# EAGLE design owl-digital-2 (EAGLE 7.5.0)
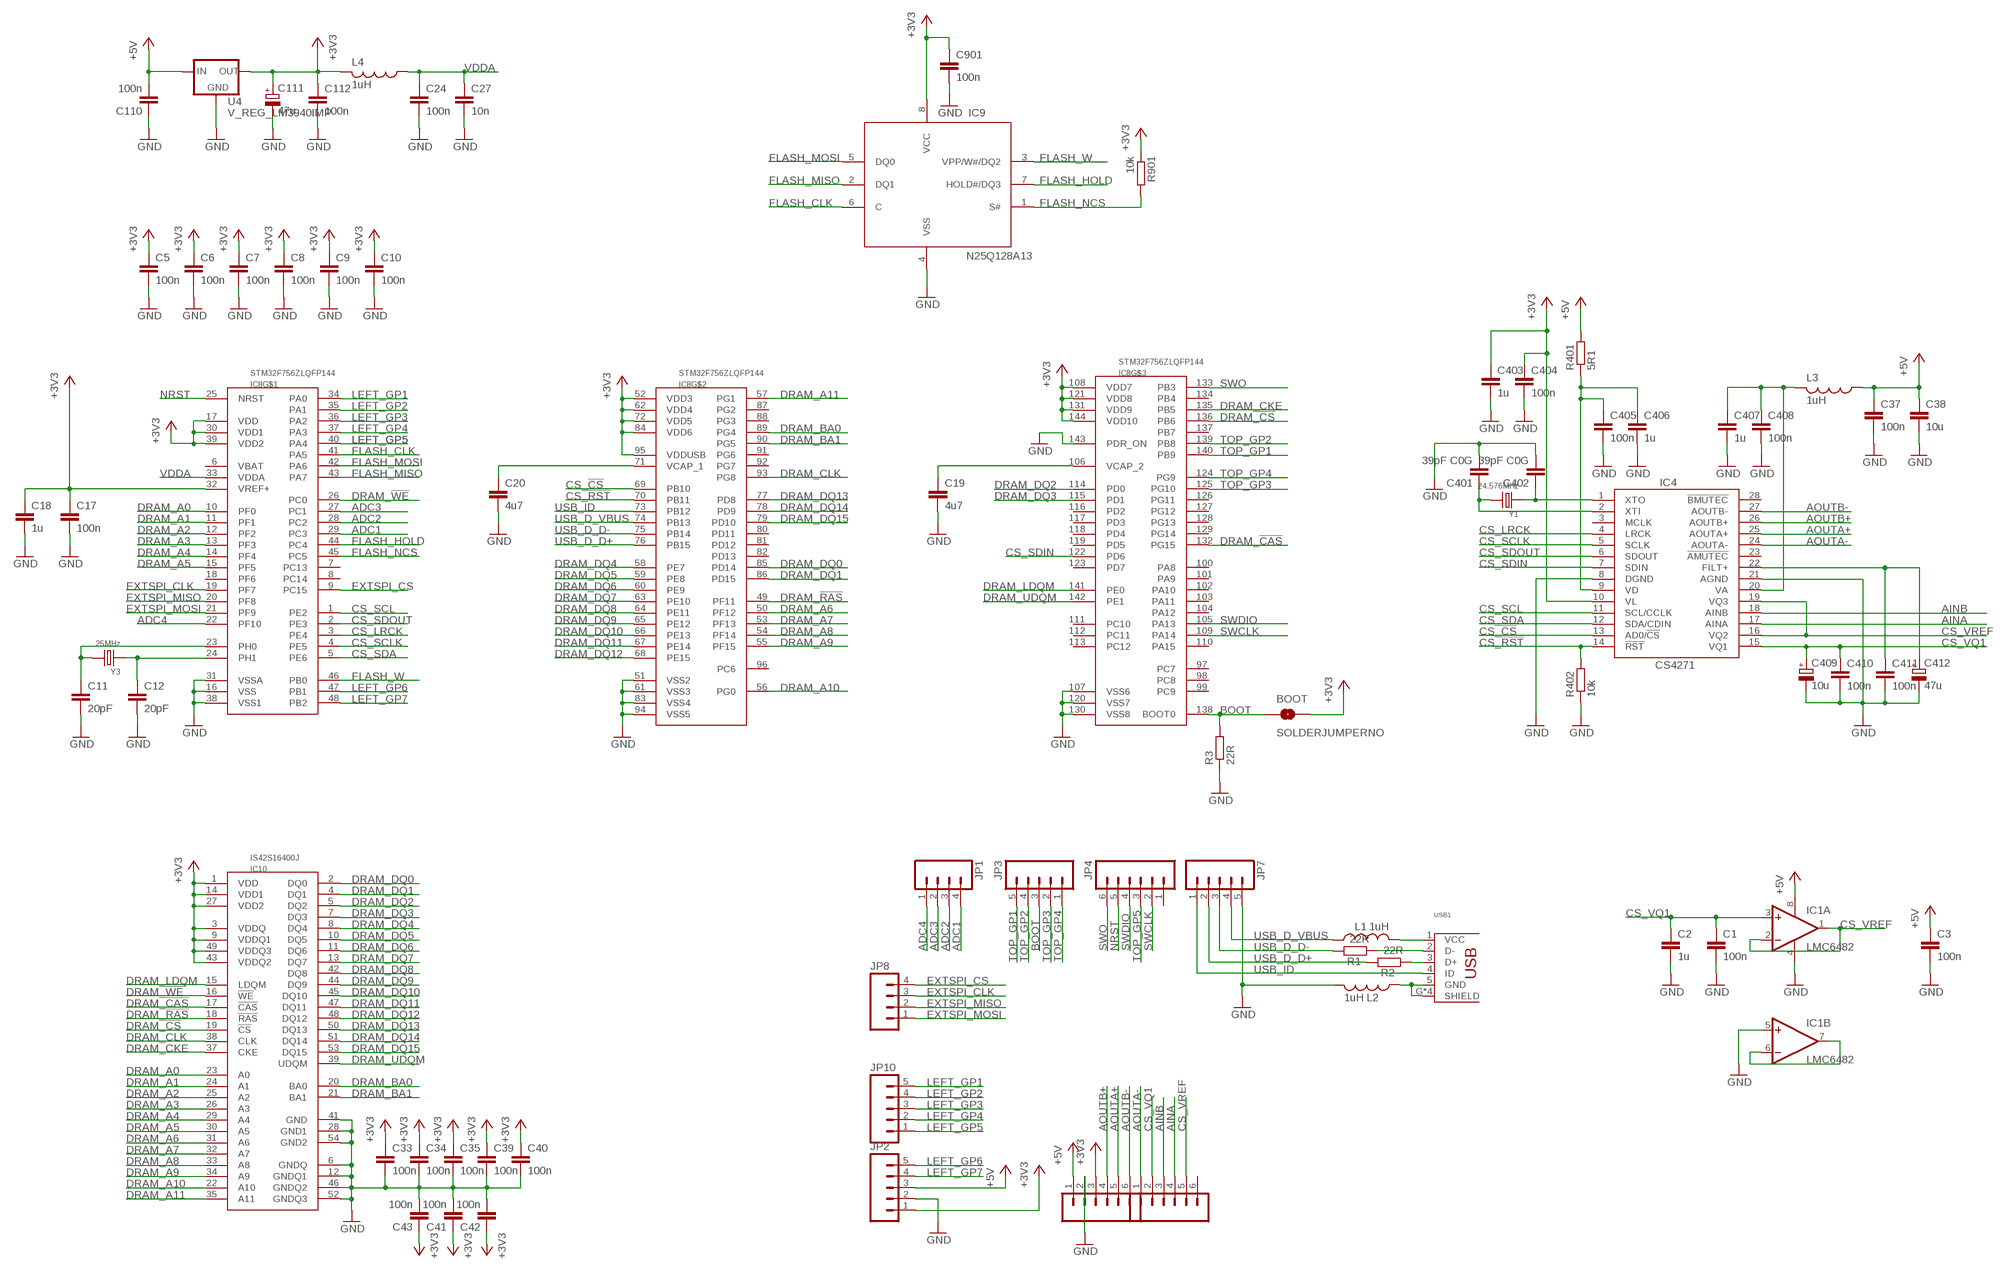
[diagram p0: schematic, sheet 1]

## Parts
BOOT  SOLDERJUMPERNO  [SJ_2S-NO]
C1  100n  C-EUC0603  [C0603]
C2  1u  C-EUC0603  [C0603]
C3  100n  C-EUC0603  [C0603]
C5  100n  C-EUC0603  [C0603]
C6  100n  C-EUC0603  [C0603]
C7  100n  C-EUC0603  [C0603]
C8  100n  C-EUC0603  [C0603]
C9  100n  C-EUC0603  [C0603]
C10  100n  C-EUC0603  [C0603]
C11  20pF  C-EUC0603  [C0603]
C12  20pF  C-EUC0603  [C0603]
C17  100n  C-EUC0603  [C0603]
C18  1u  C-EUC0603  [C0603]
C19  4u7  C-EUC0603  [C0603]
C20  4u7  C-EUC0603  [C0603]
C24  100n  C-EUC0603  [C0603]
C27  10n  C-EUC0603  [C0603]
C33  100n  C-EUC0603  [C0603]
C34  100n  C-EUC0603  [C0603]
C35  100n  C-EUC0603  [C0603]
C37  100n  C-EUC0603  [C0603]
C38  10u  C-EUC1206  [C1206]
C39  100n  C-EUC0603  [C0603]
C40  100n  C-EUC0603  [C0603]
C41  100n  C-EUC0603  [C0603]
C42  100n  C-EUC0603  [C0603]
C43  100n  C-EUC0603  [C0603]
C110  100n  C-EUC0603  [C0603]
C111  47u  CPOL-EU153CLV-0505  [CPOL-5]
C112  100n  C-EUC0603  [C0603]
C401  39pF C0G  C-EUC0603  [C0603]
C402  39pF C0G  C-EUC0603  [C0603]
C403  1u  C-EUC0603  [C0603]
C404  100n  C-EUC0603  [C0603]
C405  100n  C-EUC0603  [C0603]
C406  1u  C-EUC0603  [C0603]
C407  1u  C-EUC0603  [C0603]
C408  100n  C-EUC0603  [C0603]
C409  10u  CPOL-EU153CLV-0505  [CPOL-5]
C410  100n  C-EUC0603  [C0603]
C411  100n  C-EUC0603  [C0603]
C412  47u  CPOL-EU153CLV-0505  [CPOL-5]
C901  100n  C-EUC0603  [C0603]
IC1  LMC6482  LM1458D  [SO08]
IC4  CS4271  [TSSOP28-0.65-9.7X4.4MM]
IC8  STM32F756ZLQFP144  [QFP50P2200X2200X160-144N]
IC9  N25Q128A13  [SO8W]
IC10  IS42S16400J  [TSOP54-400]
JP1  M04PTH  [1X04]
JP2  M05PTH  [1X05]
JP3  M05PTH  [1X05]
JP4  M06SIP  [1X06]
JP5  M06SIP  [1X06]
JP6  M06SIP  [1X06]
JP7  M05PTH  [1X05]
JP8  M04PTH  [1X04]
JP10  M05PTH  [1X05]
L1  1uH  INDUCTOR  [0603]
L2  1uH  INDUCTOR  [0603]
L3  1uH  INDUCTOR  [0603]
L4  1uH  INDUCTOR  [0603]
R1  22R  R-EU_0603  [0603]
R2  22R  R-EU_0603  [0603]
R3  22R  R-EU_0603  [0603]
R401  5R1  R-EU_0603  [0603]
R402  10k  R-EU_0603  [0603]
R901  10k  R-EU_0603  [0603]
U4  V_REG_LM3940IMP  [SOT223]
USB1  USB_HRS_ZX62-B-5PA(11)MICRO.B  [HRS_ZX62RD-AB-5P8]
Y1  24.576MHz  SMD-CRYSTAL-8MHZ-20PF-20PPM(2P-5.0X3.2MM)  [X2-SMD-5.0X3.2X1.3MM]
Y3  25MHz  SMD-CRYSTAL-8MHZ-20PF-20PPM(2P-5.0X3.2MM)  [X2-SMD-5.0X3.2X1.3MM]

## Nets
+3V3: BOOT.2 C5.1 C6.1 C7.1 C8.1 C9.1 C10.1 C17.1 C18.1 C33.1 C34.1 C35.1 C39.1 C40.1 C41.1 C42.1 C43.1 C111.+ C112.1 C403.1 C404.1 C901.1 IC4.10(VL) IC8.17(VDD) IC8.30(VDD1) IC8.32(VREF+) IC8.39(VDD2) IC8.52(VDD3) IC8.62(VDD4) IC8.72(VDD5) IC8.84(VDD6) IC8.95(VDDUSB) IC8.108(VDD7) IC8.121(VDD8) IC8.131(VDD9) IC8.144(VDD10) IC9.8(VCC) IC10.1(VDD) IC10.3(VDDQ) IC10.9(VDDQ1) IC10.14(VDD1) IC10.27(VDD2) IC10.43(VDDQ2) IC10.49(VDDQ3) JP2.1 JP5.3 L4.2 R901.1 U4.3(OUT)
+5V [power]: C3.1 C37.1 C38.1 C110.2 IC1.8(P:V+) JP2.3 JP5.1 L3.1 R401.2 U4.1(IN)
ADC1: IC8.29(PC3) JP1.4
ADC2: IC8.28(PC2) JP1.3
ADC3: IC8.27(PC1) JP1.2
ADC4: IC8.22(PF10) JP1.1
AINA: IC4.17(AINA) JP6.4
AINB: IC4.18(AINB) JP6.3
AOUTA+: IC4.25(AOUTA+) JP5.5
AOUTA-: IC4.24(AOUTA-) JP6.1
AOUTB+: IC4.26(AOUTB+) JP5.4
AOUTB-: IC4.27(AOUTB-) JP5.6
BOOT: BOOT.1 IC8.138(BOOT0) JP3.3 R3.2
CS_!CS: IC4.13(AD0/!CS) IC8.69(PB10)
CS_!RST: IC4.14(!RST) IC8.70(PB11) R402.2
CS_LRCK: IC4.4(LRCK) IC8.3(PE4)
CS_SCL: IC4.11(SCL/CCLK) IC8.1(PE2)
CS_SCLK: IC4.5(SCLK) IC8.4(PE5)
CS_SDA: IC4.12(SDA/CDIN) IC8.5(PE6)
CS_SDIN: IC4.7(SDIN) IC8.122(PD6)
CS_SDOUT: IC4.6(SDOUT) IC8.2(PE3)
CS_VQ1: C1.1 C2.1 C409.+ C410.1 IC4.15(VQ1) JP6.2
CS_VREF: IC1.1(A:OUT) IC1.2(A:-IN) IC4.16(VQ2) IC4.19(VQ3) JP6.5
DRAM_!CAS: IC8.132(PG15) IC10.17(!CAS)
DRAM_!CS: IC8.136(PB6) IC10.19(!CS)
DRAM_!RAS: IC8.49(PF11) IC10.18(!RAS)
DRAM_!WE: IC8.26(PC0) IC10.16(!WE)
DRAM_A0: IC8.10(PF0) IC10.23(A0)
DRAM_A1: IC8.11(PF1) IC10.24(A1)
DRAM_A2: IC8.12(PF2) IC10.25(A2)
DRAM_A3: IC8.13(PF3) IC10.26(A3)
DRAM_A4: IC8.14(PF4) IC10.29(A4)
DRAM_A5: IC8.15(PF5) IC10.30(A5)
DRAM_A6: IC8.50(PF12) IC10.31(A6)
DRAM_A7: IC8.53(PF13) IC10.32(A7)
DRAM_A8: IC8.54(PF14) IC10.33(A8)
DRAM_A9: IC8.55(PF15) IC10.34(A9)
DRAM_A10: IC8.56(PG0) IC10.22(A10)
DRAM_A11: IC8.57(PG1) IC10.35(A11)
DRAM_BA0: IC8.89(PG4) IC10.20(BA0)
DRAM_BA1: IC8.90(PG5) IC10.21(BA1)
DRAM_CKE: IC8.135(PB5) IC10.37(CKE)
DRAM_CLK: IC8.93(PG8) IC10.38(CLK)
DRAM_DQ0: IC8.85(PD14) IC10.2(DQ0)
DRAM_DQ1: IC8.86(PD15) IC10.4(DQ1)
DRAM_DQ2: IC8.114(PD0) IC10.5(DQ2)
DRAM_DQ3: IC8.115(PD1) IC10.7(DQ3)
DRAM_DQ4: IC8.58(PE7) IC10.8(DQ4)
DRAM_DQ5: IC8.59(PE8) IC10.10(DQ5)
DRAM_DQ6: IC8.60(PE9) IC10.11(DQ6)
DRAM_DQ7: IC8.63(PE10) IC10.13(DQ7)
DRAM_DQ8: IC8.64(PE11) IC10.42(DQ8)
DRAM_DQ9: IC8.65(PE12) IC10.44(DQ9)
DRAM_DQ10: IC8.66(PE13) IC10.45(DQ10)
DRAM_DQ11: IC8.67(PE14) IC10.47(DQ11)
DRAM_DQ12: IC8.68(PE15) IC10.48(DQ12)
DRAM_DQ13: IC8.77(PD8) IC10.50(DQ13)
DRAM_DQ14: IC8.78(PD9) IC10.51(DQ14)
DRAM_DQ15: IC8.79(PD10) IC10.53(DQ15)
DRAM_LDQM: IC8.141(PE0) IC10.15(LDQM)
DRAM_UDQM: IC8.142(PE1) IC10.39(UDQM)
EXTSPI_CLK: IC8.19(PF7) JP8.3
EXTSPI_CS: IC8.9(PC15) JP8.4
EXTSPI_MISO: IC8.20(PF8) JP8.2
EXTSPI_MOSI: IC8.21(PF9) JP8.1
FLASH_CLK: IC8.41(PA5) IC9.6(C)
FLASH_HOLD: IC8.44(PC4) IC9.7(HOLD#/DQ3)
FLASH_MISO: IC8.43(PA7) IC9.2(DQ1)
FLASH_MOSI: IC8.42(PA6) IC9.5(DQ0)
FLASH_NCS: IC8.45(PC5) IC9.1(S#) R901.2
FLASH_W: IC8.46(PB0) IC9.3(VPP/W#/DQ2)
GND: C1.2 C2.2 C3.2 C5.2 C6.2 C7.2 C8.2 C9.2 C10.2 C11.2 C12.2 C17.2 C18.2 C19.2 C20.2 C24.2 C27.2 C33.2 C34.2 C35.2 C37.2 C38.2 C39.2 C40.2 C41.2 C42.2 C43.2 C110.1 C111.- C112.2 C401.2 C402.2 C403.2 C404.2 C405.2 C406.2 C407.2 C408.2 C409.- C410.2 C411.2 C412.- C901.2 IC1.4(P:V-) IC1.5(B:+IN) IC4.8(DGND) IC4.21(AGND) IC8.16(VSS) IC8.31(VSSA) IC8.38(VSS1) IC8.51(VSS2) IC8.61(VSS3) IC8.83(VSS4) IC8.94(VSS5) IC8.107(VSS6) IC8.120(VSS7) IC8.130(VSS8) IC8.143(PDR_ON) IC9.4(VSS) IC10.6(GNDQ) IC10.12(GNDQ1) IC10.28(GND1) IC10.41(GND) IC10.46(GNDQ2) IC10.52(GNDQ3) IC10.54(GND2) JP2.2 JP5.2 JP7.5 L2.2 R3.1 R402.1 U4.2(GND)
LEFT_GP1: IC8.34(PA0) JP10.5
LEFT_GP2: IC8.35(PA1) JP10.4
LEFT_GP3: IC8.36(PA2) JP10.3
LEFT_GP4: IC8.37(PA3) JP10.2
LEFT_GP5: IC8.40(PA4) JP10.1
LEFT_GP6: IC8.47(PB1) JP2.5
LEFT_GP7: IC8.48(PB2) JP2.4
N$1: L2.1 USB1.5(GND) USB1.G2(SHIELD) USB1.G3(SHIELD) USB1.G4(SHIELD) USB1.G(SHIELD)
N$2: L1.2 USB1.1(VCC)
N$3: IC1.6(B:-IN) IC1.7(B:OUT)
N$4: R2.1 USB1.3(D+)
N$5: R1.1 USB1.2(D-)
N$11: C12.1 IC8.24(PH1) Y3.1
N$17: C11.1 IC8.23(PH0) Y3.2
N$18: C402.1 IC4.1(XTO) Y1.1
N$20: C411.1 C412.+ IC4.22(FILT+)
N$21: C401.1 IC4.2(XTI) Y1.2
N$33: C19.1 IC8.106(VCAP_2)
N$34: C20.1 IC8.71(VCAP_1)
NRST: IC8.25(NRST) JP4.5
SWCLK: IC8.109(PA14) JP4.2
SWDIO: IC8.105(PA13) JP4.4
SWO: IC8.133(PB3) JP4.6
TOP_GP1: IC8.140(PB9) JP3.5
TOP_GP2: IC8.139(PB8) JP3.4
TOP_GP3: IC8.125(PG10) JP3.2
TOP_GP4: IC8.124(PG9) JP3.1
TOP_GP5: JP4.3
USB_D_D+: IC8.76(PB15) JP7.2 R2.2
USB_D_D-: IC8.75(PB14) JP7.3 R1.2
USB_D_VBUS: IC8.74(PB13) JP7.4 L1.1
USB_ID: IC8.73(PB12) JP7.1 USB1.4(ID)
VA: C407.1 C408.1 IC4.20(VA) L3.2
VD: C405.1 C406.1 IC4.9(VD) R401.1
VDDA: C24.1 C27.1 IC8.33(VDDA) L4.1
Unconnected: IC1.3(A:+IN) IC4.3(MCLK) IC4.23(!AMUTEC) IC4.28(!BMUTEC) IC8.6(VBAT) IC8.7(PC13) IC8.8(PC14) IC8.18(PF6) IC8.80(PD11) IC8.81(PD12) IC8.82(PD13) IC8.87(PG2) IC8.88(PG3) IC8.91(PG6) IC8.92(PG7) IC8.96(PC6) IC8.97(PC7) IC8.98(PC8) IC8.99(PC9) IC8.100(PA8) IC8.101(PA9) IC8.102(PA10) IC8.103(PA11) IC8.104(PA12) IC8.110(PA15) IC8.111(PC10) IC8.112(PC11) IC8.113(PC12) IC8.116(PD2) IC8.117(PD3) IC8.118(PD4) IC8.119(PD5) IC8.123(PD7) IC8.126(PG11) IC8.127(PG12) IC8.128(PG13) IC8.129(PG14) IC8.134(PB4) IC8.137(PB7) JP4.1 JP6.6

## Library data of the parts
BOOT = SparkFun:SOLDERJUMPER: Solder Jumper Standard SMD solder jumper. Used to automate production. Two varients : Normally Open and Normally Closed are the same, but have different paste layers. NC will have a large amount of paste and should jumper during reflow.
C1-C3 C5-C12 C17-C20 C24 C27 C33-C35 C37-C43 C110 C112 C401-C408 C410 C411 C901 = Rebel:C-EU: CAPACITOR, European symbol
C111 C409 C412 = Rebel:CPOL-EU: POLARIZED CAPACITOR, European symbol
IC1 = linear:*1458: OP AMP
IC4 = Rebel:CS4271
IC8 = James:STM32F756Z; OC_FARNELL: 2484975
IC9 = Rebel:N25Q128A13: N25Q128A13 Flash Memory SO8W; OC_FARNELL: 2253682
IC10 = James:IS42S16400J; OC_FARNELL: 2253831
JP1 JP8 = SparkFun:M04: Header 4 Standard 4-pin 0.1" header. Use with straight break away headers (SKU : PRT-00116), right angle break away headers (PRT-00553), swiss pins (PRT-00743), machine pins (PRT-00117), and female headers (PRT-00115). Molex polarized connector foot print use with SKU : PRT-08231 with associated crimp pins and housings. 1MM SMD Version SKU: PRT-10208
JP2 JP3 JP7 JP10 = SparkFun:M05: Header 5 Standard 5-pin 0.1" header. Use with straight break away headers (SKU : PRT-00116), right angle break away headers (PRT-00553), swiss pins (PRT-00743), machine pins (PRT-00117), and female headers (PRT-00115). Molex polarized connector foot print use with SKU : PRT-08230 with associated crimp pins and housings.
JP4-JP6 = SparkFun:M06: Header 6 Standard 6-pin 0.1" header. Use with straight break away headers (SKU : PRT-00116), right angle break away headers (PRT-00553), swiss pins (PRT-00743), machine pins (PRT-00117), and female headers (PRT-00115). Molex polarized connector foot print use with SKU : PRT-08094 with associated crimp pins and housings. NOTES ON THE VARIANTS LOCK and LOCK_LONGPADS... This footprint was designed to help hold the alignment of a through-hole component (i.e. 6-pin header) while soldering it into place. You may notice that each hole has been shifted either up or down by 0.005 of an inch from it's more standard position (which is a perfectly straight line). This slight alteration caused the pins (the squares in the middle) to touch the edges of the holes. Because they are alternating, it causes a "brace" to hold the component in place. 0.005 has proven to be the perfect amount of "off-center" position when using our standard breakaway headers. Although looks a little odd when you look at the bare footprint, once you have a header in there, the alteration is very hard to notice. Also, if you push a header all the way into place, it is covered up entirely on the bottom side. This idea of altering the position of holes to aid alignment will be further integrated into the Sparkfun Library for other footprints. It can help hold any component with 3 or more connection pins.
L1-L4 = Rebel:INDUCTOR; OC_FARNELL: 2288736
R1-R3 R401 R402 R901 = Rebel:R-EU_: RESISTOR, European symbol
U4 = James:V_REG_LM3940IMP: LM3940IMP Fixed LDO Voltage Regulator Farnell: 1469104; OC_FARNELL: 1469104
USB1 = Rebel:USB_HRS_ZX62-B-5PA(11)MICRO.B
Y1 Y3 = Seeed-OPL-crystal-osctllator:SMD-CRYSTAL-8MHZ-20PF-20PPM(2P-5.0X3.2MM): 306010004; MPN: 5032/2P; VALUE: 5032/2p

## Net classes
1 power: width 0.178 mm, drill 0.305 mm, clearance 0.178 mm to class 0, clearance 0.178 mm

## Board
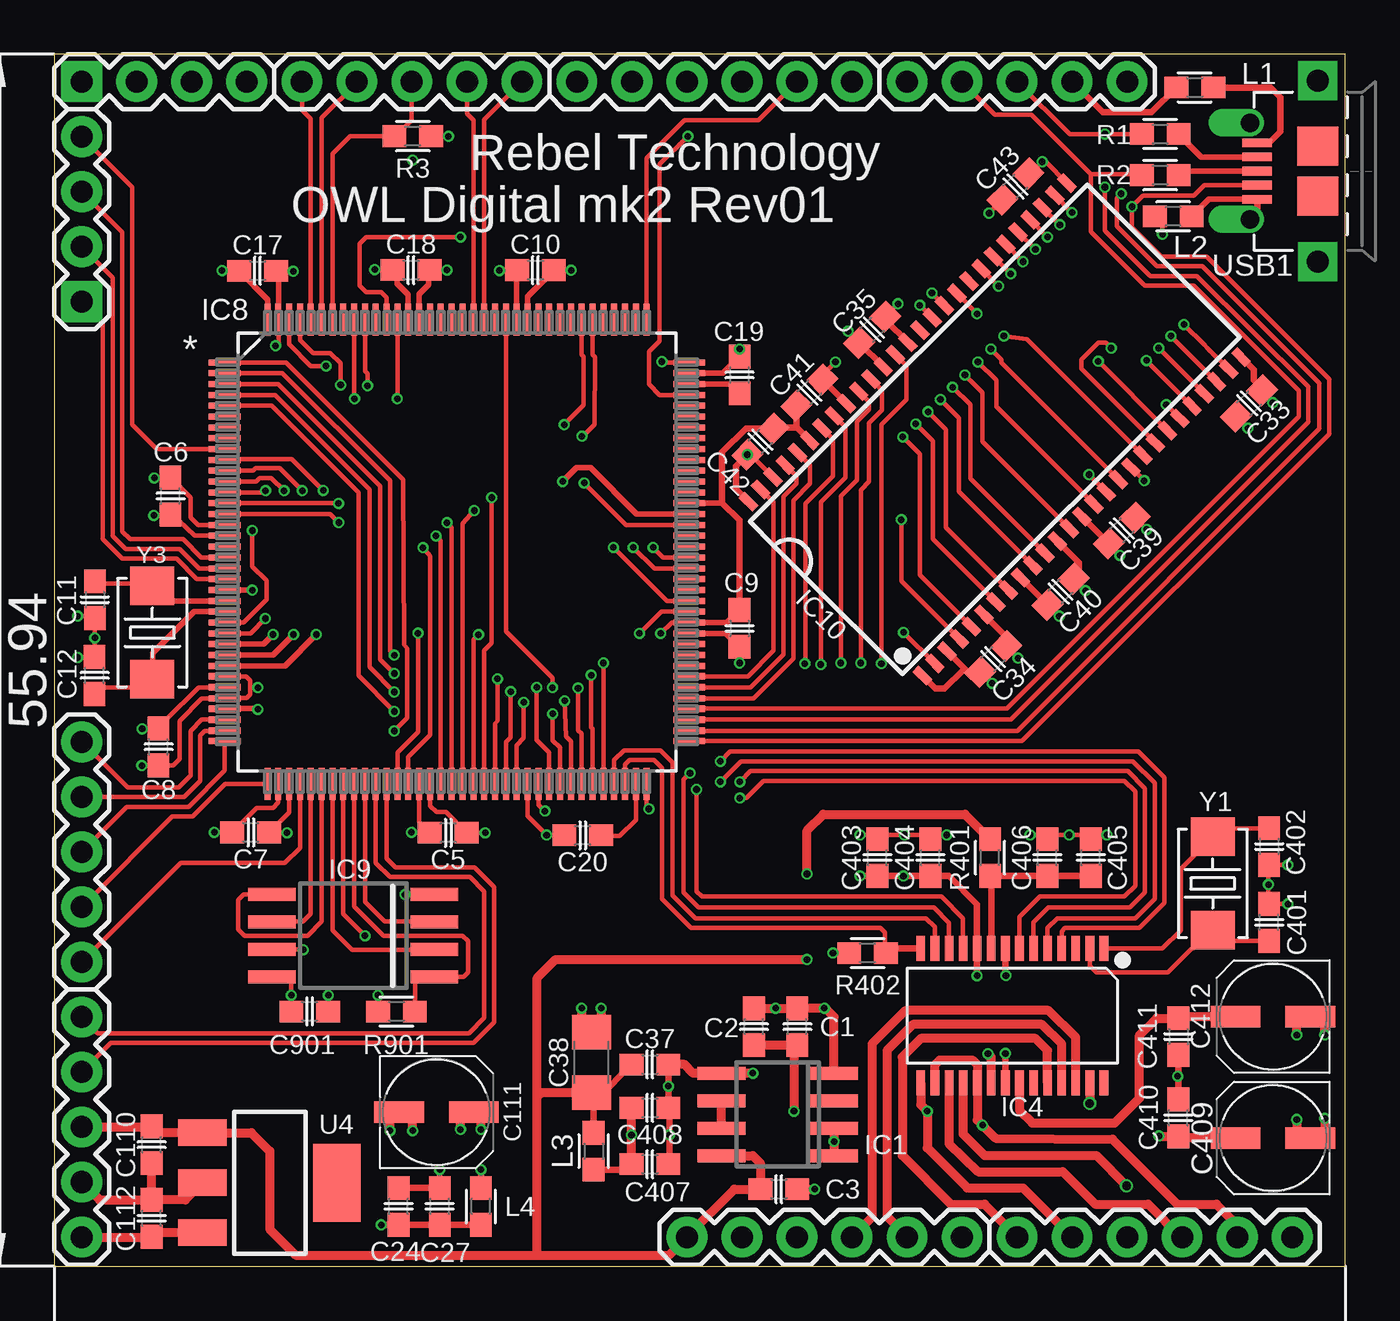
[diagram p1: board, top side]
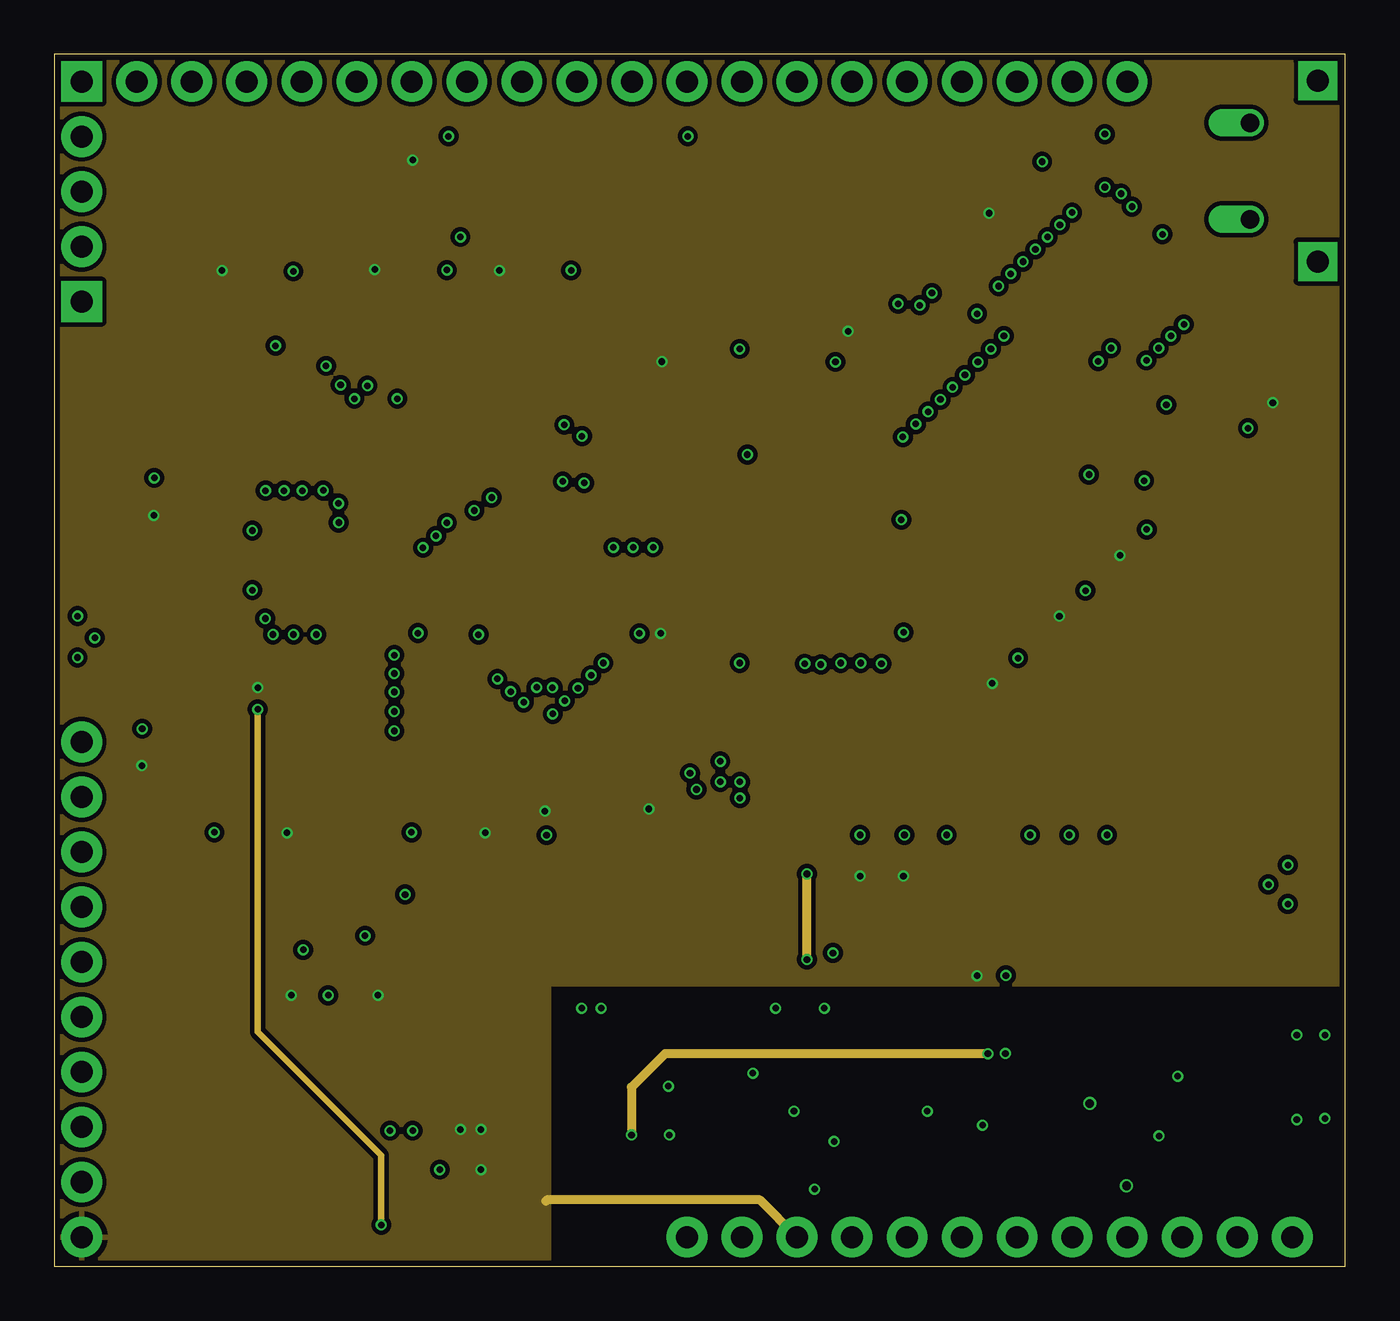
[diagram p2: board, inner layer InnerTop]
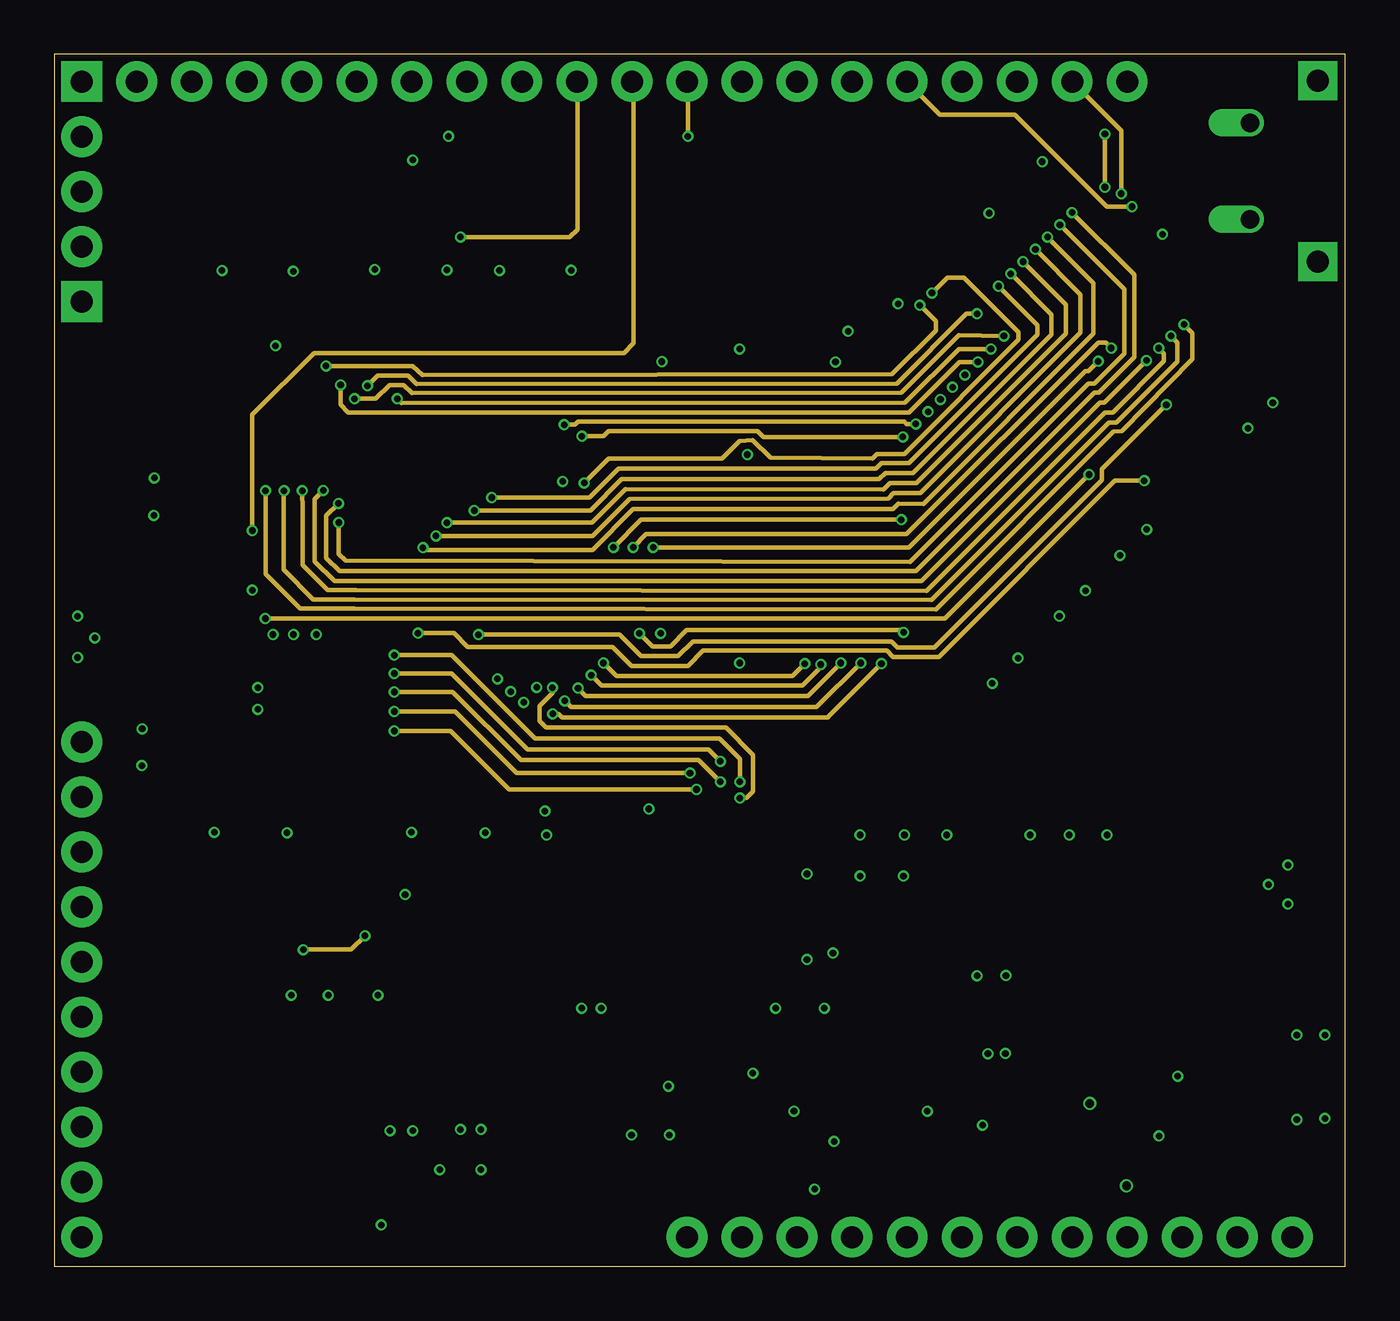
[diagram p3: board, inner layer InnerBottom]
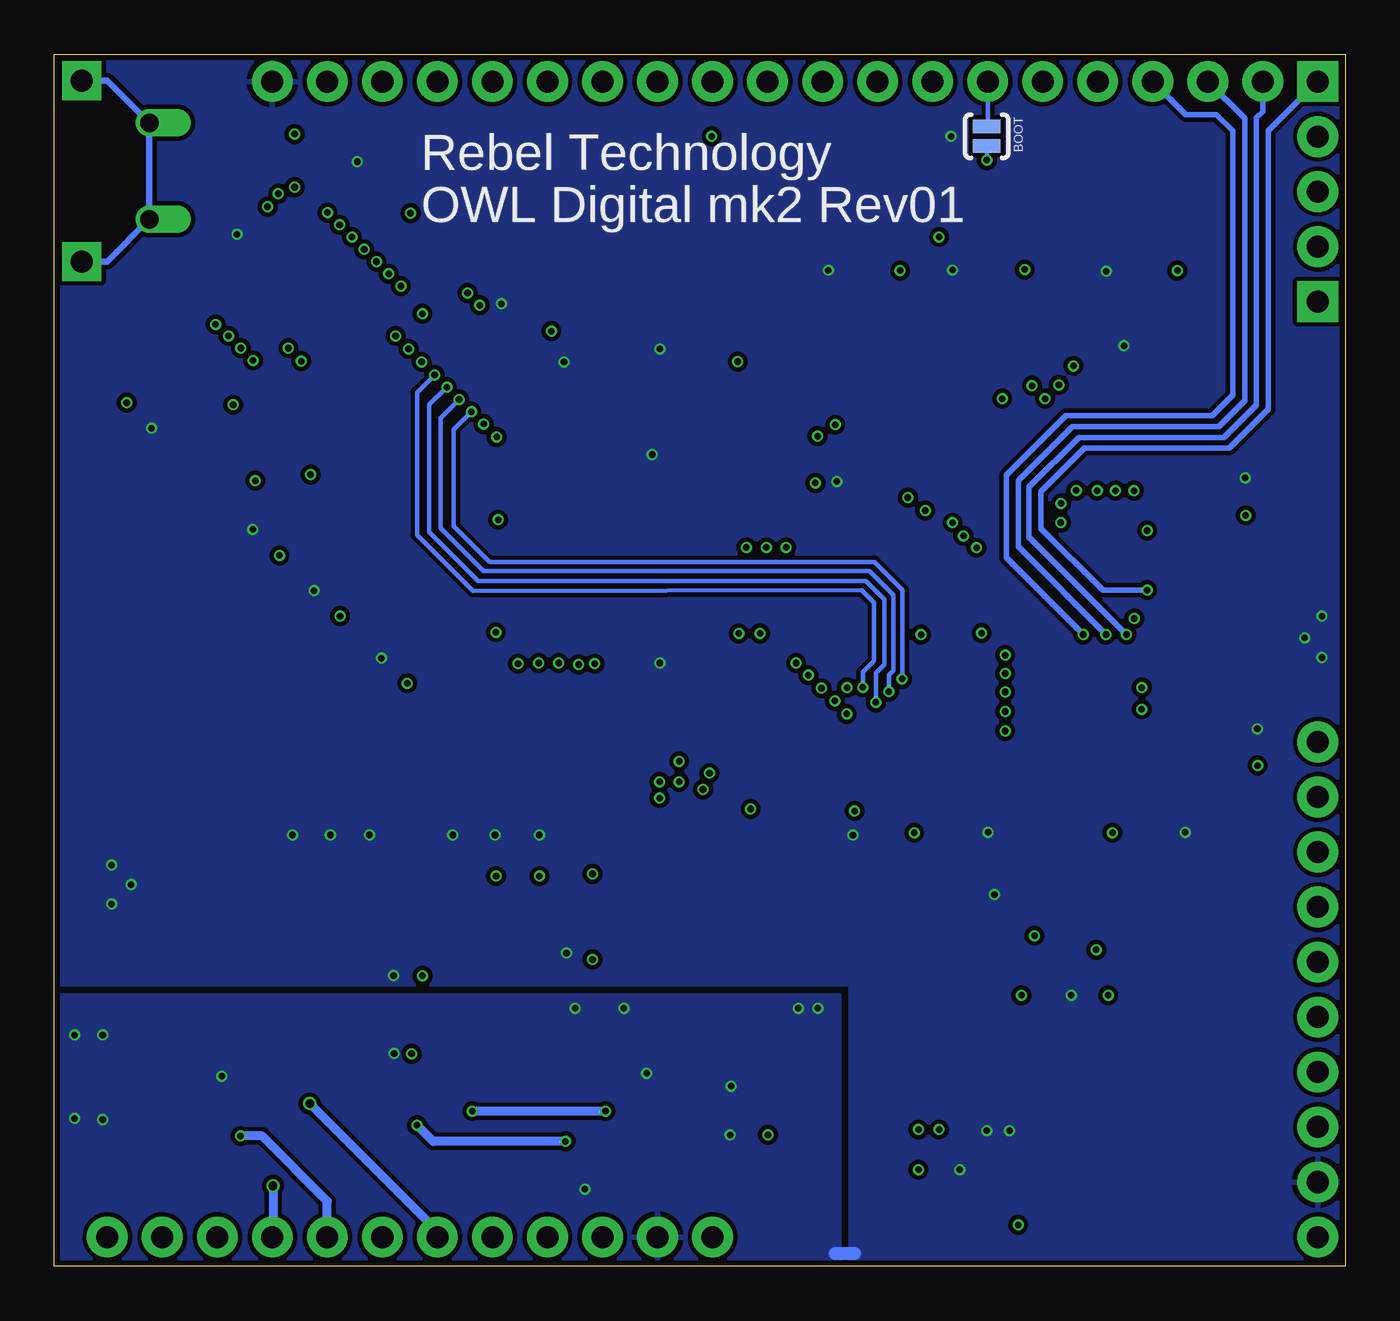
[diagram p4: board, bottom side, seen from below]

Size 59.6 x 55.94 mm. Coordinates in mm from the lower left corner, seen from the top.
Outline: 0,0 59.6,0 59.6,55.94 0,55.94 0,0
Copper layers (1*2*15*16): Top 0.035mm / dielectric 0.2mm / InnerTop 0.0175mm / dielectric 0.3mm / InnerBottom 0.0175mm / dielectric 0.2mm / Bottom 0.035mm
Design rules "SeeedStudio_4layer_DRU_no_angle_20140221": minimum track width 8mil, minimum drill 12mil, track to track 8mil, track to pad 8mil, pad to pad 8mil, via to via 8mil, smd to smd 0mil, copper to edge 10mil, drill to drill 8mil, minimum pad ring 6mil, minimum via ring 4mil, stop-mask expansion 4mil, vias tented up to drill 25mil, thermal gap 10mil

### Footprints (pad centres in the part's own frame; a part is rotated, then mirrored left to right if it is on the bottom)
SJ_2S-NO = smd 0.635 x 1.27: 1 -0.45,0; 2 0.45,0
C0603 = smd 1.1 x 1: 1 -0.85,0; 2 0.85,0
C1206 = smd 1.6 x 1.8: 1 -1.4,0; 2 1.4,0
CPOL-5 = smd 2.3 x 1: + 1.725,0; - -1.725,0
SO08 = smd 0.6 x 2.2: 1 -1.905,-2.6; 2 -0.635,-2.6; 3 0.635,-2.6; 4 1.905,-2.6; 5 1.905,2.6; 6 0.635,2.6; 7 -0.635,2.6; 8 -1.905,2.6
TSSOP28-0.65-9.7X4.4MM = smd 0.4 x 1.15: 1 -4.225,-3.1; 2 -3.575,-3.1; 3 -2.925,-3.1; 4 -2.275,-3.1; 5 -1.625,-3.1; 6 -0.975,-3.1; 7 -0.325,-3.1; 8 0.325,-3.1; 9 0.975,-3.1; 10 1.625,-3.1; 11 2.275,-3.1; 12 2.925,-3.1; 13 3.575,-3.1; 14 4.225,-3.1; 15 4.225,3.1; 16 3.575,3.1; 17 2.925,3.1; 18 2.275,3.1; 19 1.625,3.1; 20 0.975,3.1; 21 0.325,3.1; 22 -0.325,3.1; 23 -0.975,3.1; 24 -1.625,3.1; 25 -2.275,3.1; 26 -2.925,3.1; 27 -3.575,3.1; 28 -4.225,3.1
QFP50P2200X2200X160-144N = smd 1.473 x 0.279: 1 -10.719,8.738; 2 -10.719,8.255; 3 -10.719,7.747; 4 -10.719,7.239; 5 -10.719,6.756; 6 -10.719,6.248; 7 -10.719,5.74; 8 -10.719,5.258; 9 -10.719,4.75; 10 -10.719,4.242; 11 -10.719,3.759; 12 -10.719,3.251; 13 -10.719,2.743; 14 -10.719,2.261; 15 -10.719,1.753; 16 -10.719,1.245; 17 -10.719,0.762; 18 -10.719,0.254; 19 -10.719,-0.254; 20 -10.719,-0.762; 21 -10.719,-1.245; 22 -10.719,-1.753; 23 -10.719,-2.261; 24 -10.719,-2.743; 25 -10.719,-3.251; 26 -10.719,-3.759; 27 -10.719,-4.242; 28 -10.719,-4.75; 29 -10.719,-5.258; 30 -10.719,-5.74; 31 -10.719,-6.248; 32 -10.719,-6.756; 33 -10.719,-7.239; 34 -10.719,-7.747; 35 -10.719,-8.255; 36 -10.719,-8.738; 73 10.719,-8.738; 74 10.719,-8.255; 75 10.719,-7.747; 76 10.719,-7.239; 77 10.719,-6.756; 78 10.719,-6.248; 79 10.719,-5.74; 80 10.719,-5.258; 81 10.719,-4.75; 82 10.719,-4.242; 83 10.719,-3.759; 84 10.719,-3.251; 85 10.719,-2.743; 86 10.719,-2.261; 87 10.719,-1.753; 88 10.719,-1.245; 89 10.719,-0.762; 90 10.719,-0.254; 91 10.719,0.254; 92 10.719,0.762; 93 10.719,1.245; 94 10.719,1.753; 95 10.719,2.261; 96 10.719,2.743; 97 10.719,3.251; 98 10.719,3.759; 99 10.719,4.242; 100 10.719,4.75; 101 10.719,5.258; 102 10.719,5.74; 103 10.719,6.248; 104 10.719,6.756; 105 10.719,7.239; 106 10.719,7.747; 107 10.719,8.255; 108 10.719,8.738 | smd 0.279 x 1.473: 37 -8.738,-10.719; 38 -8.255,-10.719; 39 -7.747,-10.719; 40 -7.239,-10.719; 41 -6.756,-10.719; 42 -6.248,-10.719; 43 -5.74,-10.719; 44 -5.258,-10.719; 45 -4.75,-10.719; 46 -4.242,-10.719; 47 -3.759,-10.719; 48 -3.251,-10.719; 49 -2.743,-10.719; 50 -2.261,-10.719; 51 -1.753,-10.719; 52 -1.245,-10.719; 53 -0.762,-10.719; 54 -0.254,-10.719; 55 0.254,-10.719; 56 0.762,-10.719; 57 1.245,-10.719; 58 1.753,-10.719; 59 2.261,-10.719; 60 2.743,-10.719; 61 3.251,-10.719; 62 3.759,-10.719; 63 4.242,-10.719; 64 4.75,-10.719; 65 5.258,-10.719; 66 5.74,-10.719; 67 6.248,-10.719; 68 6.756,-10.719; 69 7.239,-10.719; 70 7.747,-10.719; 71 8.255,-10.719; 72 8.738,-10.719; 109 8.738,10.719; 110 8.255,10.719; 111 7.747,10.719; 112 7.239,10.719; 113 6.756,10.719; 114 6.248,10.719; 115 5.74,10.719; 116 5.258,10.719; 117 4.75,10.719; 118 4.242,10.719; 119 3.759,10.719; 120 3.251,10.719; 121 2.743,10.719; 122 2.261,10.719; 123 1.753,10.719; 124 1.245,10.719; 125 0.762,10.719; 126 0.254,10.719; 127 -0.254,10.719; 128 -0.762,10.719; 129 -1.245,10.719; 130 -1.753,10.719; 131 -2.261,10.719; 132 -2.743,10.719; 133 -3.251,10.719; 134 -3.759,10.719; 135 -4.242,10.719; 136 -4.75,10.719; 137 -5.258,10.719; 138 -5.74,10.719; 139 -6.248,10.719; 140 -6.756,10.719; 141 -7.239,10.719; 142 -7.747,10.719; 143 -8.255,10.719; 144 -8.738,10.719
SO8W = smd 0.6 x 2.2: 1 -1.905,-3.75; 2 -0.635,-3.75; 3 0.635,-3.75; 4 1.905,-3.75; 5 1.905,3.75; 6 0.635,3.75; 7 -0.635,3.75; 8 -1.905,3.75
TSOP54-400 = smd 0.4 x 0.9: 1 -10.4,-5.68; 2 -9.6,-5.68; 3 -8.8,-5.68; 4 -8,-5.68; 5 -7.2,-5.68; 6 -6.4,-5.68; 7 -5.6,-5.68; 8 -4.8,-5.68; 9 -4,-5.68; 10 -3.2,-5.68; 11 -2.4,-5.68; 12 -1.6,-5.68; 13 -0.8,-5.68; 14 0,-5.68; 15 0.8,-5.68; 16 1.6,-5.68; 17 2.4,-5.68; 18 3.2,-5.68; 19 4,-5.68; 20 4.8,-5.68; 21 5.6,-5.68; 22 6.4,-5.68; 23 7.2,-5.68; 24 8,-5.68; 25 8.8,-5.68; 26 9.6,-5.68; 27 10.4,-5.68; 28 10.4,5.68; 29 9.6,5.68; 30 8.8,5.68; 31 8,5.68; 32 7.2,5.68; 33 6.4,5.68; 34 5.6,5.68; 35 4.8,5.68; 36 4,5.68; 37 3.2,5.68; 38 2.4,5.68; 39 1.6,5.68; 40 0.8,5.68; 41 0,5.68; 42 -0.8,5.68; 43 -1.6,5.68; 44 -2.4,5.68; 45 -3.2,5.68; 46 -4,5.68; 47 -4.8,5.68; 48 -5.6,5.68; 49 -6.4,5.68; 50 -7.2,5.68; 51 -8,5.68; 52 -8.8,5.68; 53 -9.6,5.68; 54 -10.4,5.68
1X04 = drill 1.016 pad 1.88 square: 1 0,0 | drill 1.016 pad 1.88: 2 2.54,0; 3 5.08,0; 4 7.62,0
1X05 = drill 1.016 pad 1.88: 1 0,0; 2 2.54,0; 3 5.08,0; 4 7.62,0; 5 10.16,0
1X06 = drill 1.016 pad 1.88: 1 0,0; 2 2.54,0; 3 5.08,0; 4 7.62,0; 5 10.16,0; 6 12.7,0
0603 = smd 1.1 x 1: 1 -0.85,0; 2 0.85,0
SOT223 = smd 1.219 x 2.235: 1 -2.311,-3.099; 2 0,-3.099; 3 2.311,-3.099 | smd 3.6 x 2.2: 4 0,3.099
HRS_ZX62RD-AB-5P8 = smd 0.4 x 1.35: 1 1.3,2.275; 2 0.65,2.275; 3 0,2.275; 4 -0.65,2.275; 5 -1.3,2.275 | smd 1.8 x 1.9: D_0 -1.15,-0.525; D_1 1.15,-0.525 | drill 1 pad 1.8 square: G -4.175,-0.525; G2 4.175,-0.525 | drill 0.85 pad 1.016 offset: G3 -2.225,2.6; G4 2.225,2.6
X2-SMD-5.0X3.2X1.3MM = smd 1.778 x 2.032: 1 -2.159,0; 2 2.159,0

### Placement (x,y rotation side)
BOOT  16.55,52.15 270 bottom
C1  34.3,11.05 90 top
C2  32.3,11.05 90 top
C3  33.45,3.55 0 top
C5  18.19,20 180 top
C6  5.37,35.54 90 top
C7  9.07,20.01 180 top
C8  4.82,23.96 90 top
C9  31.63,29.43 270 top
C10  22.22,45.97 0 top
C11  1.88,30.76 270 top
C12  1.86,27.26 90 top
C17  9.39,45.94 0 top
C18  16.48,45.98 0 top
C19  31.64,41.13 90 top
C20  24.4,19.88 180 top
C24  15.9,2.75 90 top
C27  17.8,2.75 90 top
C33  55.15,39.82 225 top
C34  43.35,28.01 45 top
C35  37.76,43.22 45 top
C37  27.5,9.3 0 top
C38  24.8,9.4 90 top
C39  49.29,33.95 45 top
C40  46.46,31.13 45 top
C41  34.86,40.32 45 top
C42  32.6,38.06 225 top
C43  44.37,49.83 45 top
C110  4.5,5.6 90 top
C111  17.65,7.1 0 top
C112  4.5,2.2 90 top
C401  56.08,15.86 90 top
C402  56.08,19.36 270 top
C403  38,18.85 90 top
C404  40.45,18.85 90 top
C405  47.85,18.85 90 top
C406  45.85,18.85 90 top
C407  27.5,4.7 0 top
C408  27.5,7.3 0 top
C409  56.26,5.91 180 top
C410  51.89,6.84 90 top
C411  51.89,10.59 270 top
C412  56.26,11.51 180 top
C901  11.8,11.75 0 top
IC1  33.4,7 90 top
IC4  44.23,11.56 180 top
IC8  18.6,32.96 0 top
IC9  13.8,15.25 90 top
IC10  43.42,38.62 45 top
JP1  1.27,54.67 0 top
JP2  1.27,1.34 90 top
JP3  21.59,54.67 180 top
JP4  36.83,54.67 180 top
JP5  29.21,1.34 0 top
JP6  44.45,1.34 0 top
JP7  39.37,54.67 0 top
JP8  1.27,44.51 90 top
JP10  1.27,14.03 90 top
L1  52.65,54.4 0 top
L2  51.65,48.45 180 top
L3  24.9,5.3 270 top
L4  19.7,2.75 90 top
R1  51.05,52.25 180 top
R2  51.05,50.35 180 top
R3  16.55,52.15 180 top
R401  43.2,18.85 90 top
R402  37.55,14.45 0 top
R901  15.8,11.75 0 top
U4  9.95,3.85 270 top
USB1  57.8,50.54 90 top
Y1  53.48,17.66 270 top
Y3  4.53,29.24 90 top

### Tracks (layer width: path | path; a pad name or v marks a point on that pad's centre or on a via)
+3V3  (via drill 0.3)
  Top 0.204: 37.85,17.8 C403.1 | IC8.30 8.85,27.22 9.05,27.02 9.05,26.39 8.88,26.21 8.52,26.21 8.49,26.25 8.45,26.21 IC8.32 | 15.84,45.76 C18.1 14.82,45.98 v14.8,46 | 55.76,40.49 C33.1 | 34.3,38.69 34.26,38.73 | C41.1 34.3,39.75 | IC9.8 11.05,13.35 10.95,13.24 v10.95,12.5 C901.1 | 42.18,27.41 C34.1 | C5.1 | 33.3,38.69 33.27,38.66 C42.1 | IC8.144 | IC8.84 28.51,29.71 v28,29.2 | IC8.62 22.36,21.29 v22.65,21 | IC8.72 27.34,21.23 v27.45,21.1 | C5.1 v19.9,20 | v19.9,20 | C404.1 40.5,18 | C43.1 v43.15,48.6 | IC8.108 28.1,41.7 v28.05,41.75 | 21.34,45.94 C10.1 | v7.75,45.95 v7.76,45.94 C17.1 8.62,45.87 | C8.1 v4.05,23.1 | v4.6,34.65 5.37,34.65 | IC8.52 17.35,21.25 17.65,20.95 18.09,20.95 C5.1 | IC8.39 10.85,20.94 C7.1 9.94,20 v10.75,20 | v9.4,26.7 9.05,26.7
  Top 0.205: IC8.17 6.49,33.73 5.75,34.4 5.75,34.69 C6.1 | IC8.32 6.81,26.21 5.8,25.15 5.8,23.4 5.5,23.1 C8.1 | v36.65,43.15 37.16,42.64 C35.1
  Top 0.25: IC8.84 31.06,29.71 C9.1 | IC8.131 16.34,44.84 15.84,45.34 15.84,45.76 | IC8.95 30.83,35.23
  Top 0.254: IC8.121 21.34,45.94 | v20.55,45.95 21.37,45.95 C10.1 | IC8.144 9.87,44.62 C17.1
  Top 0.305: 19.15,6.88 arc-90 C111.+ 19.6,7.1 19.75,6.95 | IC4.10 | IC4.10 v42.6,13.4 | IC10.43 C35.1 | IC10.9 C40.1 45.88,30.52 v46.4,30 | IC10.27 55.37,41.38 55.37,40.88 55.76,40.49 | IC10.14 C39.1 48.69,33.31 v49.2,32.8 | IC10.49 34.3,38.69 33.3,38.69 | 34.26,38.73 C41.1 | C9.1 31.63,34.42 30.83,35.23 30.83,37.56 31.93,38.66 C42.1 | IC10.3 41.97,27.62 | 41.97,27.62 42.18,27.41 | R901.1 v14.95,12.5 | C34.1 42.79,27.41 v43.3,26.9 | IC10.1 40.68,26.65 41.1,26.65 41.97,27.52 41.97,27.62 | v56.25,39.85 55.76,40.34 C33.1 | C403.1 40.5,18 41.3,18 42.6,16.7 IC4.10 | v37.2,18 37.95,18 | L4.2 v19.7,4.45
  Top 0.406: U4.3 4.69,1.54 C112.1 4.49,1.34 JP2.1 | v18.75,6.3 18.75,7.1 19.35,7.1 | 19.35,7.1 C111.+ | v19.7,6.3 19.7,6.9 19.35,7.1 | 5.37,34.65 C6.1
  InnerTop 0.406: JP5.3 32.58,3.05 22.75,3.05 22.7,3
  Bottom 0.204: BOOT.2 v16.55,51.05
  other vias: 39.2,18
  pour InnerTop: 61.15,56.95 61,13 22.85,13 22.85,-0.9 -1.5,-0.9 -1.35,56.95
+5V  (via drill 0.3)
  Top 0.305: C37.1 25.12,7.78 24.9,7.55 L3.1
  Top 0.406: 25.12,7.78 24.9,8 C38.1 22.5,8 22.3,7.8 | 24.85,6.1 L3.1 | 6.86,6.15 U4.1 | JP2.3 4.47,6.42 C110.2 4.8,6.15 6.86,6.15 | 29.2,1.35 JP5.1 28.37,0.5 22.3,0.5 | 29.2,1.35 | 6.86,6.15 9.1,6.15 9.95,5.3 9.95,1.7 11.15,0.5 22.3,0.5 | 22.3,0.5 22.3,7.8 | 22.3,7.8 22.3,13.3 23.15,14.15 v34.75,14.15 | v34.75,18.1 34.75,20.1 35.5,20.85 42.05,20.85 R401.2 | IC1.8 32.26,5.09 32.6,4.75 C3.1 31.4,3.55 JP5.1 29.2,1.35
  InnerTop 0.406: v34.75,14.15 v34.75,18.1
ADC1  (via drill 0.3)
  Top 0.254: 10.66,27.71 IC8.29 10.66,27.71 | 10.66,27.71 v12.1,29.15
  Bottom 0.254: v12.1,29.15 15.65,32.7 15.65,36.5 12.9,39.25 6.15,39.25 5.2,40.2 5.2,52.4 5.95,53.15 7.37,53.15 JP1.4
ADC2  (via drill 0.3)
  Top 0.254: IC8.28 10.11,28.21 v11.05,29.15
  Bottom 0.254: v11.05,29.15 15.1,33.2 15.1,36.25 12.6,38.75 5.85,38.75 4.65,39.95 4.65,52.97 JP1.3
ADC3  (via drill 0.3)
  Top 0.254: IC8.27 9.67,28.72 v10.1,29.15
  Bottom 0.254: JP1.2 3.81,53.29 4.1,53 4.1,39.75 5.6,38.25 12.3,38.25 14.6,35.95 14.6,33.65 v10.1,29.15
ADC4  (via drill 0.3)
  Top 0.254: IC8.22 9.15,31.21
  Top 0.305: 9.15,31.21 v9.15,31.2
  Bottom 0.254: v9.15,31.2 11.2,31.2 14.05,34.05 14.05,35.75 12.05,37.75 5.35,37.75 3.55,39.55 3.55,52.4 JP1.1 | JP1.1 | JP1.1 1.25,54.7
AINA
  Top 0.406: IC4.17 41.3,5.64 42.65,4.35 46.55,4.35 48.05,2.85 50.5,2.85 52.01,1.34 JP6.4 52.1,1.37
AINB  (via drill 0.4)
  Top 0.406: IC4.18 41.95,6.09 42.95,5.1 48.1,5.1 v49.5,3.7
  Bottom 0.406: v49.5,3.7 49.5,1.37 JP6.3
AOUTA+
  Top 0.406: IC4.25 46.51,10.24 45.6,11.15 39.65,11.15 38.45,9.95 38.45,2.3 39.4,1.35 39.4,1.37 JP5.5
AOUTA-
  Top 0.406: IC4.24 45.85,9.95 45.3,10.5 40,10.5 39.15,9.65 39.15,5.1 41.4,2.85 42.95,2.85 JP6.1
AOUTB+
  Top 0.406: IC4.26 47.16,10.54 45.9,11.8 39.3,11.8 37.75,10.25 37.75,2.26 JP5.4
AOUTB-  (via drill 0.4)
  Top 0.406: IC4.27 v47.8,7.5
  Bottom 0.406: v47.8,7.5 41.91,1.61 JP5.6
BOOT
  Top 0.204: JP3.3 16.51,52.89 16.5,52.9 16.05,52.45 R3.2 13.66,52.16 12.85,51.35 12.85,50.35 IC8.138
  Bottom 0.204: JP3.3 16.51,52.64 BOOT.1
CS_!CS
  Top 0.204: IC4.13 40.66,15.64 40.25,16.05 34.85,16.05
  Top 0.205: 34.85,16.05 29.6,16.05 28.55,17.1 28.55,23.25 28,23.8 26.3,23.8 25.85,23.35 IC8.69
CS_!RST
  Top 0.205: 38.35,14.66 38.35,15.4 38.15,15.6 29.4,15.6 28.05,16.95 28.05,23 27.7,23.35 26.55,23.35 26.35,23.15 IC8.70
  Top 0.305: IC4.14 38.35,14.66 R402.2
CS_LRCK  (via drill 0.3)
  Top 0.204: IC4.4 46.51,15.46 46.65,15.6 50.1,15.6 51.25,16.75 51.25,22.55 50.05,23.75 31.2,23.75 v30.75,23.3 | IC8.3 10.34,40.71 15.05,36 15.05,28 v15.7,27.35
  InnerBottom 0.204: v15.7,27.35 18.35,27.35 21.85,23.85 30.2,23.85 v30.75,23.3
CS_SCL  (via drill 0.3)
  Top 0.204: IC4.11 41.95,16.05 40.95,17.05 34.85,17.05 | IC8.1 10.7,41.7 16.1,36.3 16.15,28.7 16.3,28.5 16.3,25.3 v15.7,24.7
  Top 0.205: 34.85,17.05 29.9,17.05 29.65,17.3 v29.65,22
  InnerBottom 0.205: v29.65,22 21,22 18.3,24.7 v15.7,24.7
CS_SCLK  (via drill 0.3)
  Top 0.204: IC4.5 45.85,15.61 46.3,16.05 49.9,16.05 50.8,16.95 50.8,22.3 49.8,23.3 31.7,23.3 v30.75,22.35 | IC8.4 10.2,40.2 14.55,35.85 14.55,27.65 v15.7,26.5
  InnerBottom 0.204: v15.7,26.5 18.4,26.5 21.55,23.35 29.75,23.35 v30.75,22.35
CS_SDA  (via drill 0.3)
  Top 0.204: IC4.12 41.3,15.85 40.6,16.55 34.85,16.55 | IC8.5 10.03,39.72 14.05,35.7 14.05,27.25 v15.7,25.6
  Top 0.205: 34.85,16.55 29.75,16.55 29.05,17.25 29.05,22.45 v29.35,22.75
  InnerBottom 0.204: v15.7,25.6 18.5,25.6 20.6,23.5
  InnerBottom 0.205: 20.6,23.5 21.35,22.75 v29.35,22.75
CS_SDIN  (via drill 0.3)
  Top 0.204: IC4.7 44.55,16.11 45.5,17.05 49.4,17.05 49.9,17.55 49.9,21.9 49.4,22.4 32.75,22.4 31.95,21.6 v31.65,21.6 | IC8.122 20.86,29.29 23,27.15 v23,26.7
  InnerBottom 0.204: v23,26.7 23,26.45 22.4,25.85 22.4,25.15 22.7,24.85 31,24.85 32.25,23.6 32.25,21.9 31.95,21.6 v31.65,21.6
CS_SDOUT  (via drill 0.3)
  Top 0.204: IC4.6 45.2,15.86 45.9,16.55 49.65,16.55 50.35,17.25 50.35,22.05 49.55,22.85 32.15,22.85 v31.65,22.35 | IC8.2 10.53,41.22 15.5,36.25 15.5,28.4 v15.7,28.2
  InnerBottom 0.204: v15.7,28.2 18.35,28.2 22.2,24.35 30.7,24.35 31.65,23.4 v31.65,22.35
CS_VQ1  (via drill 0.3)
  Top 0.406: IC4.15 40,7.45 v40.3,7.15 40.3,5.45 42.15,3.6 44.73,3.6 JP6.2 | C409.+ 51.97,5.91 C410.1 v51.01,5.99 v51,6 | C2.1 C1.1 34.15,10.05 v34.15,7.15
  Bottom 0.406: v51,6 50,6 46.99,2.99 JP6.2 | v34.15,7.15 v40.3,7.15
CS_VREF  (via drill 0.3)
  Top 0.406: IC4.16 40.66,9.29 40.88,9.51 42.38,9.51 42.6,9.29 IC4.19 42.6,6.75 v42.85,6.5 43.45,5.9 48.85,5.85 51.85,2.85 53.65,2.85 54.61,1.89 JP6.5 | IC1.2 IC1.1 v36,5.75
  Bottom 0.406: v36,5.75 42.1,5.75 v42.85,6.5
DRAM_!CAS  (via drill 0.3)
  Top 0.204: IC10.17 43.73,41.7 43.73,41.84 v43.24,42.33 | IC8.132 15.85,40.05 v15.84,40.03
  InnerBottom 0.204: v43.24,42.33 41.76,42.33 39.28,39.86 16.05,39.82 v15.84,40.03
DRAM_!CS  (via drill 0.3)
  Top 0.204: IC10.19 44.9,42.79 v43.84,42.93 | IC8.136 13.85,40.02 v13.86,40.03
  InnerBottom 0.204: v43.84,42.93 41.76,42.97 39.1,40.32 16.52,40.28 16.14,40.67 15.49,40.67 14.85,40.03 v13.86,40.03
DRAM_!RAS  (via drill 0.3)
  Top 0.204: IC10.18 v50.31,36.25 | IC8.49 15.85,23.7 16.8,24.65 16.8,24.77 v16.79,29.22
  InnerBottom 0.204: v50.31,36.25 48.97,36.25 40.84,28.12 38.71,28.12 38.43,28.4 29.95,28.4 29.25,27.7 26.65,27.7 25.77,28.58 19.09,28.58 18.46,29.22 v16.79,29.22
DRAM_!WE  (via drill 0.3)
  Top 0.204: IC10.16 v47.77,36.53 | IC8.26 9.06,29.2 v9.74,29.89
  InnerBottom 0.204: v47.77,36.53 41.12,29.89 v9.74,29.89
DRAM_A0  (via drill 0.3)
  Top 0.204: IC10.23 v50.42,41.8 | IC8.10 8.2,37.21 8.24,37.24 10.95,37.24 v12.42,35.8
  InnerBottom 0.204: v12.42,35.8 12.03,35.41 12.03,32.52 12.94,31.62 40.02,31.62 48.26,39.86 48.47,39.86 v50.42,41.8
DRAM_A1  (via drill 0.3)
  Top 0.204: IC10.24 v50.98,42.37 | IC8.11 9.19,36.72 9.3,36.83 10.42,36.83 v11.46,35.79
  InnerBottom 0.204: v11.46,35.79 11.46,34.84 11.46,32.36 12.63,31.2 13.93,31.2 40.27,31.16 48.51,39.4 48.86,39.4 51.23,41.77 51.23,42.12 v50.98,42.37
DRAM_A2  (via drill 0.3)
  Top 0.204: IC8.12 9.32,36.22 9.48,36.37 10.03,36.37 v10.61,35.79 | 53.56,40.83 IC10.25 52.73,41.75 52.63,41.85 v51.55,42.93
  InnerBottom 0.204: v51.55,42.93 51.85,42.63 51.85,41.75 49.04,38.94 48.69,38.94 40.48,30.74 13.86,30.77 11.96,30.77 10.59,32.15 10.59,35.77 v10.61,35.79
DRAM_A3  (via drill 0.3)
  Top 0.204: IC8.13 9.67,35.71 v9.76,35.79 | v52.15,43.47 53.11,42.5 53.21,42.4 IC10.26
  InnerBottom 0.204: v52.15,43.47 52.54,43.07 52.54,41.86 49.29,38.55 48.9,38.52 40.69,30.31 13.86,30.35 11.35,30.35 9.76,31.94 9.76,34.04 v9.76,35.79
DRAM_A4  (via drill 0.3)
  Top 0.204: IC10.29 v46.99,48.63 | IC8.14 13.05,35.23 v13.12,35.21
  InnerBottom 0.204: v46.99,48.63 49.85,45.76 49.85,41.95 48.23,40.32 48.01,40.32 39.77,32.08 13.17,32.08 12.56,32.68 12.56,34.65 v13.12,35.21
DRAM_A5  (via drill 0.3)
  Top 0.204: IC10.30 v46.42,48.06 | IC8.15 12.44,34.72 12.74,34.72 v13.14,34.32
  InnerBottom 0.204: v46.42,48.06 49.39,45.09 49.39,42.12 48.01,40.74 47.73,40.74 39.49,32.51 13.45,32.55 13.14,32.87 v13.14,34.32
DRAM_A6  (via drill 0.3)
  Top 0.204: IC8.50 16.34,23.5 17.35,24.51 17.35,32.78 v17.03,33.16 | IC10.31 v45.86,47.49
  InnerBottom 0.204: v45.86,47.49 47.98,45.37 47.98,43.04 40.11,35.18 38.96,35.2 38.71,34.95 26.73,34.94 24.84,33.06 17.13,33.06 v17.03,33.16
DRAM_A7  (via drill 0.3)
  Top 0.204: IC8.53 17.84,33.5 v17.63,33.71 | IC10.32 v45.29,46.93
  InnerBottom 0.204: v17.63,33.71 24.86,33.71 26.55,35.4 38.5,35.42 38.75,35.67 39.99,35.69 47.38,43.08 47.38,44.84 v45.29,46.93
DRAM_A8  (via drill 0.3)
  Top 0.204: IC8.54 18.34,34.09 v18.13,34.31 | IC10.33 v44.73,46.36
  InnerBottom 0.204: v18.13,34.31 24.82,34.31 26.38,35.86 38.29,35.85 38.57,36.13 39.81,36.15 46.7,43.04 46.7,44.38 v44.73,46.36
DRAM_A9  (via drill 0.3)
  Top 0.204: IC8.55 18.85,34.27 v19.39,34.87 | IC10.34 v44.16,45.8
  InnerBottom 0.204: v19.39,34.87 24.75,34.87 26.2,36.32 38.08,36.32 38.36,36.61 39.63,36.61 46.03,43.01 46.03,43.92 v44.16,45.8
DRAM_A10  (via drill 0.3)
  Top 0.204: IC10.22 v51.34,39.75 | IC8.56 19.36,28.92 v19.59,29.15
  InnerBottom 0.204: v19.59,29.15 26.1,29.15 27.1,28.15 28.8,28.15 29.48,28.83 38.64,28.83 38.93,28.55 40.62,28.55 48.37,36.29 48.37,36.78 v51.34,39.75
DRAM_A11  (via drill 0.3)
  Top 0.204: IC10.35 v43.59,45.23 | IC8.57 19.84,28.41 20.19,28.76 20.19,34.13 v20.2,35.47
  InnerBottom 0.204: v20.2,35.47 24.71,35.47 26.06,36.82 37.94,36.82 38.18,37.06 39.46,37.06 45.39,43 45.39,43.43 v43.59,45.23
DRAM_BA0  (via drill 0.3)
  Top 0.204: IC8.89 27.7,32.2 v26.73,33.18 | v48.79,42.37 48.54,42.62 48.19,42.62 47.41,41.84 47.41,41.41 IC10.20
  InnerBottom 0.204: v26.73,33.18 27.33,33.78 39.35,33.78 48.19,42.62 48.54,42.62 v48.79,42.37
DRAM_BA1  (via drill 0.3)
  Top 0.204: IC8.90 28.11,32.71 v27.65,33.18 | IC10.21 v48.19,41.77
  InnerBottom 0.204: v27.65,33.18 39.46,33.18 47.59,41.31 47.73,41.31 v48.19,41.77
DRAM_CKE  (via drill 0.3)
  Top 0.204: IC10.37 v42.6,43.96 | IC8.135 14.36,41.31 14.46,41.2 v14.46,40.64
  InnerBottom 0.204: v42.6,43.96 42.11,43.96 38.89,40.74 16.74,40.71 16.35,41.1 14.92,41.1 v14.46,40.64
DRAM_CLK  (via drill 0.3)
  Top 0.204: IC8.93 26.4,34.21 v24.47,36.15 | IC10.38 v40.52,44.91
  InnerBottom 0.204: v24.47,36.15 25.6,37.28 30.83,37.28 31.64,38.09 32.24,38.13 33.06,37.31 37.76,37.28 37.97,37.49 39.24,37.49 44.51,42.76 44.51,43.11 42,45.62 41.23,45.62 v40.52,44.91
DRAM_DQ0  (via drill 0.3)
  Top 0.204: IC10.2 v39.21,29.25 | IC8.85 28.03,30.22 v27.02,29.2
  InnerBottom 0.204: v39.21,29.25 39.11,29.35 29.2,29.35 28.45,28.6 27.62,28.6 v27.02,29.2
DRAM_DQ1  (via drill 0.3)
  Top 0.204: IC10.4 39.1,31.62 v39.1,34.45 | IC8.86 28.28,30.7 v25.81,33.18
  InnerBottom 0.204: v39.1,34.45 27.08,34.45 v25.81,33.18
DRAM_DQ2  (via drill 0.3)
  Top 0.204: IC10.5 39.95,31.9 39.95,37.49 v39.17,38.27 | IC8.114 24.85,42.06 24.96,41.95 24.95,38.84 24.41,38.3 v24.36,38.3
  InnerBottom 0.204: v39.17,38.27 32.74,38.27 32.46,38.55 25.6,38.55 25.35,38.3 v24.36,38.3
DRAM_DQ3  (via drill 0.3)
  Top 0.204: IC10.7 40.55,33.56 40.55,38.09 v39.77,38.87 | IC8.115 24.34,42.07 24.43,41.98 24.44,39.73 v23.55,38.83
  InnerBottom 0.204: v39.77,38.87 39.35,38.87 39.24,38.98 24.18,38.98 24.04,38.83 v23.55,38.83
DRAM_DQ4  (via drill 0.3)
  Top 0.204: IC10.8 41.15,34.1 41.15,38.62 v40.34,39.43 | IC8.58 20.35,25.03 20.46,25.19 v20.46,27.1
  Bottom 0.204: v40.34,39.43 41.15,38.62 41.15,34.17 39.49,32.51 21.74,32.51 20.44,31.2 20.44,27.32 v20.46,27.1
DRAM_DQ5  (via drill 0.3)
  Top 0.204: IC10.10 41.76,35.76 41.76,39.15 v40.91,40 | IC8.59 20.86,24.19 21.07,24.41 v21.07,26.52
  Bottom 0.204: v40.91,40 41.76,39.15 41.76,34.06 39.77,32.08 21.96,32.08 20.86,30.98 20.86,27.5 21.07,27.29 v21.07,26.52
DRAM_DQ6  (via drill 0.3)
  Top 0.204: IC10.11 42.28,36.36 42.28,39.75 v41.47,40.57 | v21.67,26.02 21.67,24.37 21.34,24.04 IC8.60
  Bottom 0.204: v41.47,40.57 42.28,39.75 42.28,33.88 40.02,31.62 22.13,31.62 21.28,30.77 21.28,27.77 21.67,27.38 v21.67,26.02
DRAM_DQ7  (via drill 0.3)
  Top 0.204: IC10.13 42.85,38.05 42.85,40.32 v42.04,41.13 | v22.27,26.71 22.27,24.28 22.84,23.71 IC8.63
  Bottom 0.204: v42.04,41.13 42.85,40.32 42.85,33.74 40.27,31.16 22.34,31.2 21.77,30.63 21.77,27.93 22.27,27.42 v22.27,26.71
DRAM_DQ8  (via drill 0.3)
  Top 0.204: IC10.42 39.35,41.56 39.35,40 38.18,38.83 v38.18,27.8 | IC8.64 23.35,23.94 23.02,24.27 v23.02,25.49
  InnerBottom 0.204: 35.74,25.36 v38.18,27.8
  InnerBottom 0.205: v23.02,25.49 23.29,25.49 23.45,25.33 35.71,25.33 35.74,25.36
DRAM_DQ9  (via drill 0.3)
  Top 0.204: IC10.44 38.22,40.42 38.22,39.51 37.62,38.9 37.62,36.22 37.23,35.83 v37.23,27.84 | IC8.65 23.86,24.22 23.62,24.45 v23.57,26.09
  InnerBottom 0.204: v23.57,26.09 23.86,25.8 35.19,25.8 v37.23,27.84
DRAM_DQ10  (via drill 0.3)
  Top 0.204: IC10.45 37.62,39.9 37.62,39.54 37.05,38.98 37.05,36.29 36.31,35.55 v36.31,27.84 | IC8.66 24.34,24.57 24.18,24.73 v24.18,26.67
  InnerBottom 0.204: v36.31,27.84 34.79,26.32 24.54,26.32 v24.18,26.67
DRAM_DQ11  (via drill 0.3)
  Top 0.204: IC10.47 36.52,38.73 36.52,36.39 35.39,35.26 v35.39,27.77 | 24.78,24.94 v24.78,27.27
  Top 0.205: IC8.67 24.85,24.81 24.78,24.87 24.78,24.94
  InnerBottom 0.204: v35.39,27.77 35.39,27.64 34.54,26.79 25.27,26.79 v24.78,27.27
DRAM_DQ12  (via drill 0.3)
  Top 0.204: v34.65,27.8 34.68,27.84 34.68,35.19 35.96,36.46 35.96,38.16 IC10.48 35.43,38.69 | 25.35,27.62 v25.35,27.84 IC8.68
  InnerBottom 0.204: v34.65,27.8 34.08,27.24 25.95,27.24 v25.35,27.84
DRAM_DQ13
  Top 0.204: IC8.77 32.28,26.21 34.12,28.05 34.12,35.33 34.89,36.11 34.89,36.96 IC10.50
DRAM_DQ14
  Top 0.204: IC8.78 32.15,26.72 33.66,28.23 33.66,35.51 34.26,36.11 34.26,36.47 IC10.51
DRAM_DQ15
  Top 0.204: IC8.79 32.02,27.22 33.2,28.4 33.2,35.26 IC10.53
DRAM_LDQM  (via drill 0.3)
  Top 0.204: IC10.15 43.49,39.68 43.49,40.88 v42.64,41.73 | 11.35,43.75 11.36,43.74 IC8.141 11.36,42.74 11.95,42.15 12.75,42.15 13.22,41.68 v13.22,40.67
  InnerBottom 0.204: v42.64,41.73 41.79,41.73 39.46,39.4 13.58,39.4 13.22,39.75 v13.22,40.67
DRAM_UDQM  (via drill 0.3)
  Top 0.204: IC10.39 v39.95,44.35 | IC8.142 10.85,42.55 11.85,41.55 v12.55,41.55
  InnerBottom 0.204: v39.95,44.35 40.69,43.61 40.69,43.18 38.68,41.17 17,41.13 16.55,41.55 v12.55,41.55
EXTSPI_CLK
  Top 0.205: IC8.19 6.79,32.71 5.95,33.55 3.5,33.55 3.15,33.9 3.15,47.71 JP8.3
EXTSPI_CS
  Top 0.204: JP8.4 3.6,49.8 3.6,38.85 4.74,37.71 IC8.9
EXTSPI_MISO
  Top 0.205: IC8.20 6.7,32.2 5.8,33.1 3.3,33.1 2.7,33.7 2.7,45.62 JP8.2
EXTSPI_MOSI
  Top 0.205: IC8.21 6.58,31.72 5.65,32.65 3.15,32.65 2.25,33.55 2.25,43.53 JP8.1 1.25,44.49
FLASH_CLK
  Top 0.204: 10.05,15.9 IC9.6 10.06,15.9 11.5,15.9 11.85,16.25 11.85,18.95 11.84,19.36 IC8.41
FLASH_HOLD  (via drill 0.3)
  Top 0.204: 10.05,14.6 IC9.7 11.48,14.62 v11.5,14.6 | IC8.44 13.34,20.11 13.35,20.05 13.35,16.25 v14.35,15.25
  InnerBottom 0.204: v14.35,15.25 13.71,14.62 11.52,14.62 v11.5,14.6
FLASH_MISO
  Top 0.204: IC8.43 12.86,19.84 12.85,19.85 12.85,15.5 13.75,14.6 17.54,14.6 IC9.2
FLASH_MOSI
  Top 0.204: IC8.42 12.35,19.6 12.35,15.9 11.7,15.25 8.8,15.25 8.5,15.55 8.5,16.9 8.75,17.15 IC9.5
FLASH_NCS
  Top 0.204: R901.2 16.65,13.35 IC9.1 18.9,13.35 19.1,13.55 19.1,15 18.85,15.25 15.2,15.25 13.85,16.6 13.85,20.3 IC8.45
FLASH_W
  Top 0.204: IC9.3 17.54,15.9 15.25,15.9 14.35,16.8 14.35,20.5 14.36,20.5 IC8.46
GND  (via drill 0.3)
  Top 0.204: v56.95,16.71 C401.2 | v56.95,18.51 C402.2 | C11.2 1.88,29.84 1.85,29.95 1.85,30 v1.08,30 | v1.08,28.09 1.8,28.09 1.8,28.1 1.91,28.46 C12.2 1.88,29.77 1.98,29.88 | v4.07,24.8 C8.2 4.97,24.81 | C6.2 5.37,36.78 5.35,36.45 5.35,36.38 v4.62,36.38 | 17.29,45.94 C18.2 17.4,46 v18.13,45.98 | C10.2 23.4,45.97 v23.86,45.96 | v11.04,45.91 C17.2 | 10.36,43.7 IC8.143 | v31.64,42.33 C19.2 | v16.5,20.02 16.96,20 C5.2 16.84,20.49 IC8.51 | C20.2 v22.73,19.89 21.85,20.77 IC8.61 | v31.64,27.84 31.63,28.27 C9.2 | 38.4,43.64 C35.2 v38.96,44.42 | C33.2 v55.11,38.67 | v50.43,34 C39.2 | C40.2 v47.61,31.17 | 43.95,29.04 C34.2 v44.49,28.06 | R402.1 v35.95,14.45 | v28.4,6.05 28.35,7.65 C408.2 | 28.7,4.7 28.4,4.7 C407.2 | 28.4,7.1 28.3,7.2 | R3.1 v18.2,52.15 | IC9.4 v16.2,17.15 | C901.2 v12.65,12.5 | IC10.52 32.07,37.52 C42.2 | C41.2 35.67,41.13 35.67,41.34 v36.06,41.73 | C405.2 47.65,19.9 v46.85,19.9 v45.05,19.9 46.05,19.9 C406.2 | v37.2,19.9 37.8,19.9 | 37.8,19.9 C403.2 | v41.2,19.9 40.65,19.9 C404.2 | 37.8,19.9 40.6,19.9 | v48.6,19.9 47.8,19.9 | C43.2 45.06,50.43 v45.61,50.98 45.77,50.98 IC10.28 | 10.36,43.61 10.36,42.62 v10.22,42.48 | IC8.38 10.34,21.39 10.1,21.15 9.36,21.15 C7.2 8.18,20.02 v7.4,20.02 | L2.2 50.77,48.42 51.15,48.05 51.16,48.04 v51.16,47.62 | 56.05,16.71 56.05,18.51
  Top 0.205: IC8.16 6.64,34.21 6.3,34.55 6.3,35.46 C6.2 | IC8.31 6.67,26.72 5.15,25.2 4.9,25.1 C8.2
  Top 0.25: IC8.107 30.88,41.22 C19.2 | IC8.83 31.01,29.2 C9.2 | IC8.120 21.85,44.75 C10.2 | IC8.130 16.84,44.86 17.29,45.3 17.29,45.94
  Top 0.254: IC8.94 26.89,34.72 24.75,36.85 24.11,36.85 v23.48,36.22 | 10.36,43.7 10.36,45.82 C17.2 | C27.2 v17.8,4.45
  Top 0.305: IC4.21 43.91,9.19 v43.91,9.81 | IC10.41 38.4,43.64 | IC10.12 47.31,32.47 47.31,31.73 C40.2 | IC10.6 43.95,29.04 | C37.2 28.35,7.65 | 28.4,4.7 28.4,7.1 | IC10.46 C41.2 | IC10.54 31.47,35.86 31.47,36.92 C42.2 | IC4.8 43.91,13.44 v43.93,13.41 | C410.2 C411.2 51.89,8.79 v51.86,8.76 | 15.8,6.97 arc-90 C111.- 15.5,6.67 | C24.2 C27.2
  Top 0.406: v24.35,11.9 24.35,11.25 C38.2 | v25.25,11.9 25.25,10.85 25.1,10.7 | C408.2 28.35,7.25 28.3,7.2 | v57.36,10.66 57.36,11.44 57.25,11.55 57.95,11.55 C412.- 58.02,11.55 58.7,11.55 58.66,11.51 v58.66,10.66 | v57.36,6.76 57.36,5.91 57.35,5.9 C409.- 58.05,5.85 58.65,5.85 58.66,5.86 v58.66,6.81 | C112.2 C110.1 | U4.2 6.05,3.05 C112.2 | JP2.2 2.1,3.05 C112.2 | v15.5,6.25 15.5,6.67 | v16.55,6.25 16.55,6.95 | C2.2 C1.2 v35.55,11.9 35.6,11.9 36,11.5 IC1.4 | C3.2 v35.1,3.55 | IC1.5 29.5,8.9 29.1,9.3 C37.2 | v32.25,8.9 30.95,8.9 30.9,8.95 | 56.05,16.71 C401.2
  Bottom 0.61: 23.55,0.58 22.65,0.58
  other vias: 28.35,8.3 32,37.45 1.88,29 39.25,19.9 33.3,11.9 56.05,17.61
  pour Bottom: 61,57 61,13 22.85,13 22.85,-0.9 -1.5,-0.9 -1.5,57
  pour Bottom: 61,12.5 61,-0.9 23.35,-0.9 23.35,12.5
LEFT_GP1
  Top 0.204: IC8.34 6.82,25.22 6.3,24.7 6.3,22.65 5.75,22.1 3.4,22.1 1.3,24.2 JP10.5
LEFT_GP2
  Top 0.204: JP10.4 6,21.65 6.75,22.4 6.75,24.5 6.96,24.71 IC8.35
LEFT_GP3
  Top 0.204: JP10.3 3.35,21.2 6.2,21.2 7.88,22.88 IC8.36
LEFT_GP4
  Top 0.204: JP10.2 2.6,17.9 4.35,19.65 5.45,20.75 6.4,20.75 7.89,22.25 IC8.37
LEFT_GP5
  Top 0.204: JP10.1 5.84,18.6 10.65,18.6 11.36,19.31 IC8.40
LEFT_GP6
  Top 0.204: IC8.47 14.84,18.61 15.5,17.95 19.2,17.95 19.85,17.3 19.85,11.45 19.15,10.75 2.02,10.75 JP2.5
LEFT_GP7
  Top 0.204: IC8.48 15.35,18.8 15.75,18.4 19.4,18.4 20.3,17.5 20.3,11.25 19.35,10.3 2.61,10.3 JP2.4
N$1
  Top 0.254: USB1.5 53.29,49.24 L2.1
  Top 0.305: USB1.5 55.53,48.6 USB1.G3
  Bottom 0.305: USB1.G2 57.15,54.72 USB1.G4 USB1.G3 57.15,46.37 USB1.G
N$2
  Top 0.254: USB1.1 56.05,51.8
  Top 0.305: 56.05,51.8 56.6,52.35 56.6,53.95 56.15,54.4 L1.2
N$3
  Top 0.406: IC1.7 IC1.6
N$4
  Top 0.254: USB1.3 52.09,50.54 R2.1
N$5
  Top 0.254: USB1.2 52.96,51.19 R1.1
N$11
  Top 0.204: 4.39,26.8 Y3.1 | 4.32,26.87 Y3.1 | C12.1 1.95,26.41 1.95,26.7 3.9,26.7 3.93,26.73 4.03,26.84 4.16,26.71 Y3.1
  Top 0.254: IC8.24 6.47,30.22 4.55,28.3 4.55,27.1 Y3.1
N$17
  Top 0.204: IC8.23 | C11.1 1.9,31.61 1.9,31.5 3.8,31.5 3.8,31.55 3.79,31.54 4.18,31.93 4.18,31.75 Y3.2
  Top 0.254: IC8.23 5.1,30.7 5.1,30.9 4.53,30.9 Y3.2
N$18
  Top 0.204: C402.1 53.48,20.21 Y1.1 52,18.34 52,15.5 51.16,14.66 IC4.1
N$20
  Top 0.406: IC4.22 44.55,7.2 45.15,6.6 48.95,6.6 50.1,7.75 50.1,10.65 50.89,11.44 C411.1 51.96,11.51 C412.+
N$21
  Top 0.204: C401.1 53.48,15.01 | 53.48,15.01 Y1.2 53.44,15.46 | IC4.2 47.8,13.85 48.1,13.55 51.4,13.55 52.5,14.65 53.5,14.99 53.48,15.01
N$33
  Top 0.204: 31.21,40.71 C19.1
  Top 0.25: IC8.106 31.21,40.71
N$34
  Top 0.204: 25.35,19.99 C20.1 | IC8.71 26.85,20.6 26.1,19.85 25.28,19.85
  Top 0.305: 25.28,19.85 C20.1
NRST  (via drill 0.3)
  Top 0.204: IC8.25 8.75,29.71 9.8,30.76 9.8,31.65 9.15,32.3 v9.15,33.95
  InnerBottom 0.204: JP4.5 arc-90 26.75,54.59 26.75,42.6 26.3,42.15 12,42.15 9.15,39.3 v9.15,33.95
SWCLK
  Top 0.204: IC8.109 27.34,51.13 29.1,52.9 32.52,52.9 JP4.2
SWDIO  (via drill 0.3)
  Top 0.204: IC8.105 27.95,40.2 27.45,40.7 27.45,42.2 27.95,42.7 27.95,50.85 v29.25,52.15
  InnerBottom 0.204: v29.25,52.15 29.25,54.63 JP4.4
SWO  (via drill 0.3)
  Top 0.204: IC8.133 15.35,44.7 15.1,44.95 14.4,44.95 14.1,45.25 14.1,47.2 14.4,47.5 v18.75,47.5
  InnerBottom 0.204: v18.75,47.5 23.8,47.5 24.15,47.85 24.15,54.65 JP4.6
TOP_GP1
  Top 0.204: IC8.140 11.84,52.96 11.45,53.35 11.45,54.65 JP3.5
TOP_GP2
  Top 0.204: IC8.139 12.35,53 14,54.65 14,54.64 JP3.4
TOP_GP3
  Top 0.204: IC8.125 19.36,52.89 19.05,53.2 JP3.2
TOP_GP4
  Top 0.204: IC8.124 19.84,52.92 JP3.1
USB_D_D+
  Top 0.204: IC8.76 43.98,25.73 57.45,39.2 57.45,40.4 52.6,45.25 50.35,45.25 47.85,47.75 47.85,50.4 | JP7.2 43.43,53.15 45.1,53.15 47.85,50.4 | R2.2 50.15,50.4 47.85,50.4
USB_D_D-  (via drill 0.3)
  Top 0.204: IC8.75 44.17,25.22 57.9,38.95 57.9,40.6 52.75,45.7 50.6,45.7 48.5,47.8 v48.5,49.8 | JP7.3 46.87,52.25 v48.5,52.25 R1.2
  InnerBottom 0.204: v48.5,49.8 v48.5,52.25
USB_D_VBUS  (via drill 0.3)
  Top 0.204: IC8.74 44.46,24.71 58.4,38.65 58.4,40.75 53,46.15 50.9,46.15 49.05,48 49.05,49.3 v49.25,49.5
  Top 0.305: JP7.4 48.4,53.25 50.65,53.25 L1.1
  InnerBottom 0.204: v49.25,49.5 49.25,52.41 JP7.4
USB_ID  (via drill 0.3)
  Top 0.204: USB1.4 54.35,49.9 53.1,49.9 52.6,49.4 50.25,49.4 v49.75,48.9 49.75,47.95 51.1,46.6 53.2,46.6 58.85,40.95 58.85,38.4 44.68,24.23 IC8.73
  InnerBottom 0.204: v49.75,48.9 48.6,48.9 44.35,53.15 40.89,53.15 JP7.1
VA  (via drill 0.3)
  Top 0.204: C407.1 26.65,4.45 | L3.2 24.9,4.35 25,4.25
  Top 0.305: 26.65,4.45 L3.2
  Top 0.406: IC4.20 43.26,9.64 v43.1,9.8 | C407.1 v26.65,6.05 C408.1
  InnerTop 0.406: v26.65,6.05 26.65,8.25 28.2,9.8 v43.1,9.8
VD
  Top 0.305: C405.1 C406.1 R401.1 43.26,17.95 IC4.9
VDDA  (via drill 0.3)
  Top 0.204: 19.6,1.9 L4.1 | 9.38,25.73 v9.4,25.7
  Top 0.254: IC8.33 9.38,25.73
  Top 0.305: L4.1 C27.1 C24.1 v15.1,1.9
  InnerTop 0.305: v15.1,1.9 15.1,5.1 9.4,10.8 v9.4,25.7

### Text on the board
tPlace: Rebel Technology | OWL Digital mk2 Rev01
bPlace: Rebel Technology | OWL Digital mk2 Rev01